# Altium project Humpback.PrjPCB (part 2 of 4)

## Sheet Supply.SchDoc: Humpback
size 420 x 297 mm; EDA_Number: ARTIQ; Projet: Humpback; Author: G.Kasprowicz; CompanyName: WUT ISE; DrawnBy: G.Kasprowicz; Organization: WUT ISE; Address1: PW ISE; Address2: Nowowiejska 15/19 00-665 Warsaw; Address3: gkasprow@gmail.com; DocumentNumber: 5; Revision: 1.0; SheetNumber: 5; SheetTotal: 11; ModifiedBy: -; CheckedDate: -; Title2: Supply v1.0; DivGrp: WUT ISE; Designer: G.Kasprowicz; ModifiedDate: -; ProjectName: Sensor Box
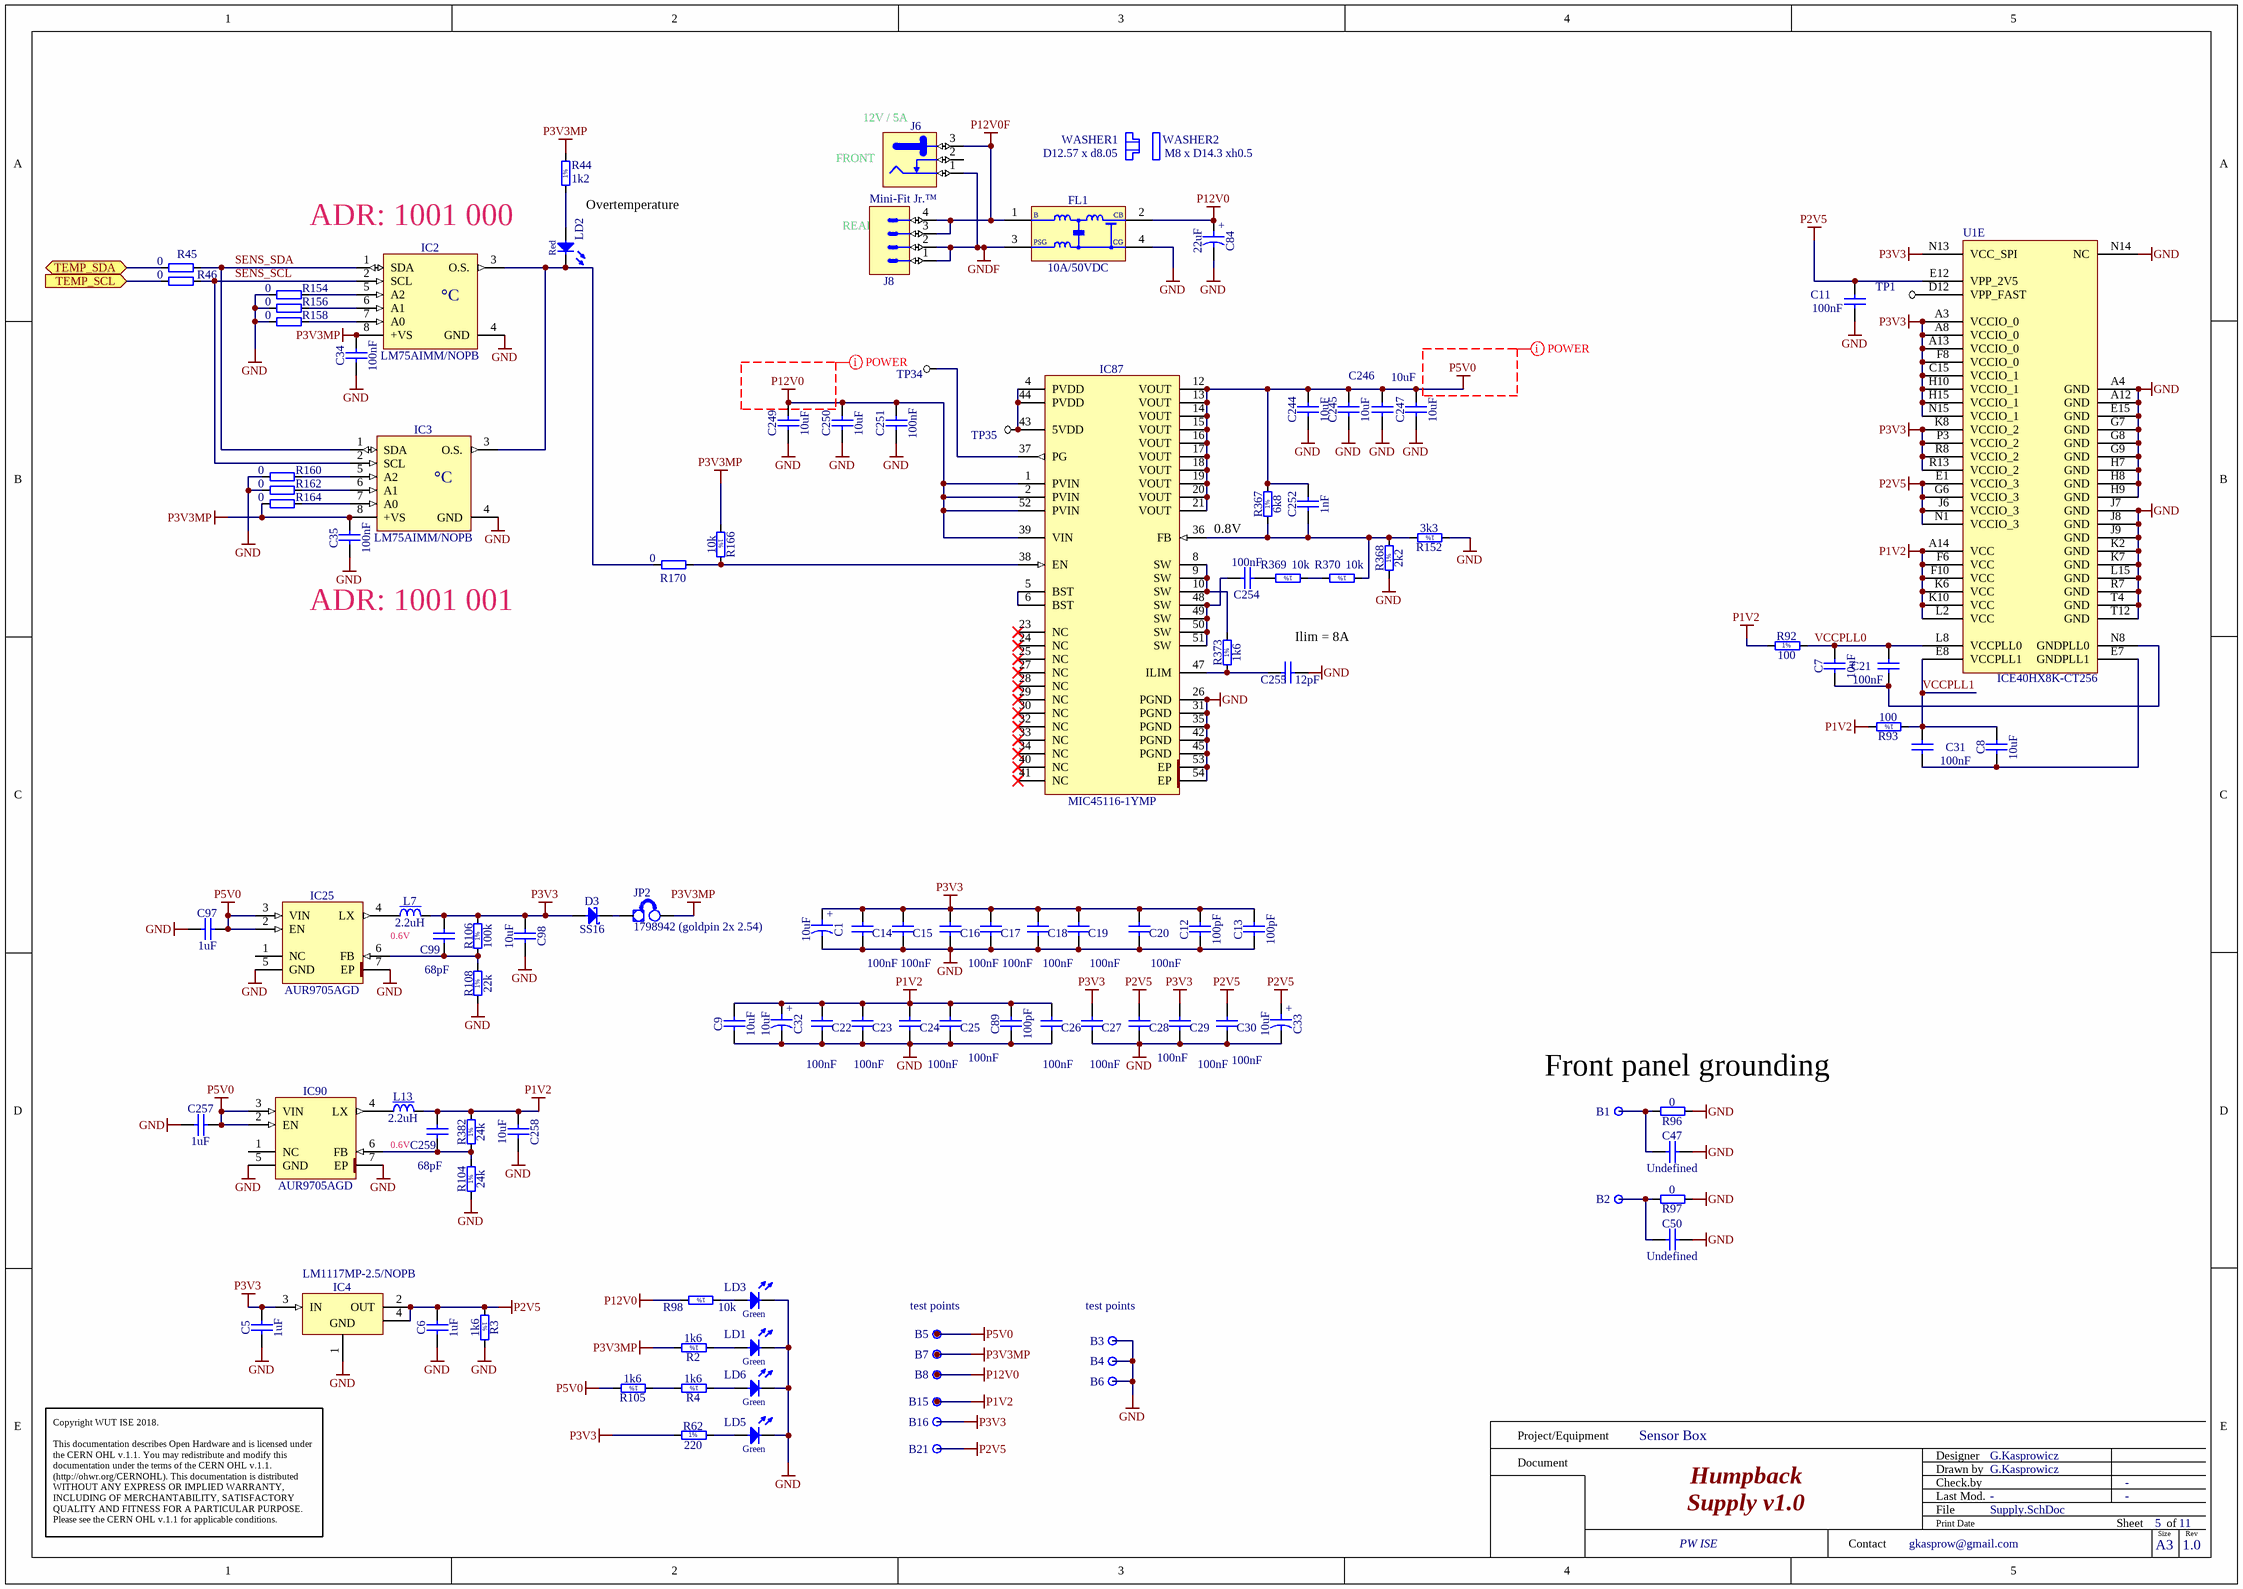
[diagram p4: Supply.SchDoc]

### Parts
B1  Plated Hole  [MTG270_500]  (value not drawn)
B2  Plated Hole  [MTG270_500]  (value not drawn)
B3  Plated Hole  [c130h60]  (value not drawn)
B4  Plated Hole  [c130h60]  (value not drawn)
B5  Plated Hole  [c130h60]  (value not drawn)
B6  Plated Hole  [c130h60]  (value not drawn)
B7  Plated Hole  [c130h60]  (value not drawn)
B8  Plated Hole  [c130h60]  (value not drawn)
B15  Plated Hole  [c130h60]  (value not drawn)
B16  Plated Hole  [c130h60]  (value not drawn)
B21  Plated Hole  [c130h60]  (value not drawn)
C1  10uF  [CAPAE430X540N]
C5  1uF  [CAPC1608X87N]
C6  1uF  [CAPC1608X87N]
C7  10uF  [CAPC1005X70N]
C8  10uF  [CAPC1005X70N]
C9  10uF  [CAPC2012X135N]
C11  100nF  [CAPC1005X55N]
C12  100pF  [CAPC1608X87N]
C13  100pF  [CAPC1608X87N]
C14  100nF  [CAPC1005X55N]
C15  100nF  [CAPC1005X55N]
C16  100nF  [CAPC1005X55N]
C17  100nF  [CAPC1005X55N]
C18  100nF  [CAPC1005X55N]
C19  100nF  [CAPC1005X55N]
C20  100nF  [CAPC1005X55N]
C21  100nF  [CAPC1005X55N]
C22  100nF  [CAPC1005X55N]
C23  100nF  [CAPC1005X55N]
C24  100nF  [CAPC1005X55N]
C25  100nF  [CAPC1005X55N]
C26  100nF  [CAPC1005X55N]
C27  100nF  [CAPC1005X55N]
C28  100nF  [CAPC1005X55N]
C29  100nF  [CAPC1005X55N]
C30  100nF  [CAPC1005X55N]
C31  100nF  [CAPC1005X55N]
C32  10uF  [CAPAE430X540N]
C33  10uF  [CAPAE430X540N]
C34  100nF  [CAPC1005X55N]
C35  100nF  [CAPC1005X55N]
C47  Undefined  [CAPC2012X135N]
C50  Undefined  [CAPC2012X135N]
C84  22uF  [CAPAE530X540N]
C89  100pF  [CAPC1608X87N]
C97  1uF  [CAPC1005X55N]
C98  10uF  [CAPC2012X135N]
C99  68pF  [CAPC1608X87N]
C244  10uF  [CAPC2012X135N]
C245  10uF  [CAPC2012X135N]
C246  10uF  [CAPC2012X135N]
C247  10uF  [CAPC2012X135N]
C249  10uF  [CAPC2012X135N]
C250  10uF  [CAPC2012X135N]
C251  100nF  [CAPC1005X55N]
C252  1nF  [CAPC1608X87N]
C254  100nF  [CAPC1005X55N]
C255  12pF  [CAPC1005X55N]
C257  1uF  [CAPC1005X55N]
C258  10uF  [CAPC2012X135N]
C259  68pF  [CAPC1608X87N]
D3  SS16  [DIOM5127X229N]
FL1  10A/50VDC  [FIL_MURATA_BNX02]
IC2  LM75AIMM/NOPB  [SOP65P490X109-8N]
IC3  LM75AIMM/NOPB  [SOP65P490X109-8N]
IC4  LM1117MP-2.5/NOPB  [SOT230P700X180-4N]
IC25  AUR9705AGD  [SON65P200X200X80-7N-R65X145]
IC87  MIC45116-1YMP  [MICROCHIP_H3QFN88-52LD-PL-3]
IC90  AUR9705AGD  [SON65P200X200X80-7N-R65X145]
J6  Jack  [SWITCHCRAFT_L712RA]  (value not drawn)
J8  Mini-Fit Jr.™  [MOLEX_39-30-0040]
JP2  1798942 (goldpin 2x 2.54)  [jump]
L7  2.2uH  [IND_MURATA_LQH44PN_P0]
L13  2.2uH  [IND_MURATA_LQH44PN_P0]
LD1  Green  [LED_KINGBRIGHT_KPH-1608CGCK]  (value not drawn)
LD2  Red  [LED_AVAGO_HSMC-C120]
LD3  Green  [LED_KINGBRIGHT_KPH-1608CGCK]  (value not drawn)
LD5  Green  [LED_KINGBRIGHT_KPH-1608CGCK]  (value not drawn)
LD6  Green  [LED_KINGBRIGHT_KPH-1608CGCK]  (value not drawn)
R2  1k6  [RESC1005X40N]
R3  1k6  [RESC1005X40N]
R4  1k6  [RESC1005X40N]
R44  1k2  [RESC1608X55N]
R45  0  [RESC1005X40N]
R46  0  [RESC1005X40N]
R62  220  [RESC1608X55N]
R92  100  [RESC1005X40N]
R93  100  [RESC1005X40N]
R96  0  [RESC1608X55N]
R97  0  [RESC1608X55N]
R98  10k  [RESC1005X40N]
R104  24k  [RESC1005X40N]
R105  1k6  [RESC1005X40N]
R106  100k  [RESC1005X40N]
R108  22k  [RESC1005X40N]
R152  3k3  [RESC1005X40N]
R154  0  [RESC1005X40N]
R156  0  [RESC1005X40N]
R158  0  [RESC1005X40N]
R160  0  [RESC1005X40N]
R162  0  [RESC1005X40N]
R164  0  [RESC1005X40N]
R166  10k  [RESC1005X40N]
R170  0  [RESC1005X40N]
R367  6k8  [RESC1005X40N]
R368  2k2  [RESC1608X55N]
R369  10k  [RESC1005X40N]
R370  10k  [RESC1005X40N]
R373  1k6  [RESC1005X40N]
R382  24k  [RESC1005X40N]
TP1  TP  [TP]  (value not drawn)
TP34  TP  [TP]  (value not drawn)
TP35  TP  [TP]  (value not drawn)
U1  ICE40HX8K-CT256  [LATC-caBGA-256]  (part E of 5)
WASHER1  D12.57 x d8.05  [Washer_s4263]
WASHER2  M8 x D14.3 xh0.5  [Washer_M8x0.5x14.3]

### Ports
TEMP_SCL (in), TEMP_SDA (bidir)

### Nets
GND: B3.1 B4.1 B6.1 C1.2 C5.1 C6.1 C9.1 C11.1 C12.1 C13.1 C14.1 C15.1 C16.1 C17.1 C18.1 C19.1 C20.1 C22.1 C23.1 C24.1 C25.1 C26.1 C27.1 C28.1 C29.1 C30.1 C32.2 C33.2 C34.1 C35.1 C47.2 C50.2 C84.2 C89.1 C97.1 C98.2 C244.1 C245.1 C246.1 C247.1 C249.1 C250.1 C251.1 C255.1 C257.1 C258.2 FL1.4(CG) IC2.4(GND) IC3.4(GND) IC4.1(GND) IC25.5(GND) IC25.7(EP) IC87.26(PGND) IC87.31(PGND) IC87.35(PGND) IC87.42(PGND) IC87.45(PGND) IC87.53(EP) IC87.54(EP) IC90.5(GND) IC90.7(EP) LD1.1(C) LD3.1(C) LD5.1(C) LD6.1(C) R3.2 R96.1 R97.1 R104.1 R108.1 R152.1 R154.1 R156.1 R158.1 R160.1 R162.1 R368.1 U1.A4(GND) U1.A12(GND) U1.E15(GND) U1.G7(GND) U1.G8(GND) U1.G9(GND) U1.H7(GND) U1.H8(GND) U1.H9(GND) U1.J7(GND) U1.J8(GND) U1.J9(GND) U1.K2(GND) U1.K7(GND) U1.L15(GND) U1.N14(NC) U1.R7(GND) U1.T4(GND) U1.T12(GND)
GNDF: FL1.3(PSG) J6.1 J8.1 J8.2
P1V2: B15.1 C9.2 C22.2 C23.2 C24.2 C25.2 C26.2 C32.1 C89.2 C258.1 C259.2 L13.2 R92.1 R93.2 R382.2 U1.A14(VCC) U1.F6(VCC) U1.F10(VCC) U1.K6(VCC) U1.K10(VCC) U1.L2(VCC)
P2V5: B21.1 C6.2 C11.2 C28.2 C30.2 C33.1 IC4.2(OUT) IC4.4(OUT) R3.1 U1.E1(VCCIO_3) U1.E12(VPP_2V5) U1.G6(VCCIO_3) U1.J6(VCCIO_3) U1.N1(VCCIO_3)
P3V3: B16.1 C1.1 C5.2 C12.2 C13.2 C14.2 C15.2 C16.2 C17.2 C18.2 C19.2 C20.2 C27.2 C29.2 C98.1 C99.2 D3.2(A) IC4.3(IN) L7.2 R62.1 R106.2 U1.A3(VCCIO_0) U1.A8(VCCIO_0) U1.A13(VCCIO_0) U1.C15(VCCIO_1) U1.F8(VCCIO_0) U1.H10(VCCIO_1) U1.H15(VCCIO_1) U1.K8(VCCIO_2) U1.N13(VCC_SPI) U1.N15(VCCIO_1) U1.P3(VCCIO_2) U1.R8(VCCIO_2) U1.R13(VCCIO_2)
P3V3MP: B7.1 C34.2 C35.2 IC2.8(+VS) IC3.8(+VS) JP2.2(E2) R2.2 R44.2 R164.1 R166.1
P5V0: B5.1 C97.2 C244.2 C245.2 C246.2 C247.2 C252.2 C257.2 IC25.2(EN) IC25.3(VIN) IC87.12(VOUT) IC87.13(VOUT) IC87.14(VOUT) IC87.15(VOUT) IC87.16(VOUT) IC87.17(VOUT) IC87.18(VOUT) IC87.19(VOUT) IC87.20(VOUT) IC87.21(VOUT) IC90.2(EN) IC90.3(VIN) R105.2 R367.2
P12V0: B8.1 C84.1 C249.2 C250.2 C251.2 FL1.2(CB) IC87.1(PVIN) IC87.2(PVIN) IC87.39(VIN) IC87.52(PVIN) R98.2
P12V0F: FL1.1(B) J6.3 J8.3 J8.4
SENS_SCL: IC2.2(SCL) IC3.2(SCL) R46.2
SENS_SDA: IC2.1(SDA) IC3.1(SDA) R45.2
TEMP_SCL: R46.1 ; port TEMP_SCL
TEMP_SDA: R45.1 ; port TEMP_SDA
VCCPLL0: C7.2 C21.2 R92.2 U1.L8(VCCPLL0)
VCCPLL1: C8.2 C31.2 R93.1 U1.E8(VCCPLL1)
NetB1_1: B1.1 C47.1 R96.2
NetB2_1: B2.1 C50.1 R97.2
NetC7_1: C7.1 C21.1 U1.N8(GNDPLL0)
NetC8_1: C8.1 C31.1 U1.E7(GNDPLL1)
NetC99_1: C99.1 IC25.6(FB) R106.1 R108.2
NetC252_1: C252.1 IC87.36(FB) R152.2 R367.1 R368.2 R370.1
NetC254_1: C254.1 R369.2
NetC254_2: C254.2 IC87.48(SW) IC87.49(SW) IC87.50(SW) IC87.51(SW)
NetC255_2: C255.2 IC87.47(ILIM) R373.1
NetC259_1: C259.1 IC90.6(FB) R104.2 R382.1
NetD3_1: D3.1(C) JP2.1(E1)
NetIC2_3: IC2.3(O.S.) IC3.3(O.S.) LD2.1(C) R170.1
NetIC2_5: IC2.5(A2) R154.2
NetIC2_6: IC2.6(A1) R156.2
NetIC2_7: IC2.7(A0) R158.2
NetIC3_5: IC3.5(A2) R160.2
NetIC3_6: IC3.6(A1) R162.2
NetIC3_7: IC3.7(A0) R164.2
NetIC25_4: IC25.4(LX) L7.1
NetIC87_4: IC87.4(PVDD) IC87.43(5VDD) IC87.44(PVDD) TP35.1
NetIC87_5: IC87.5(BST) IC87.6(BST)
NetIC87_8: IC87.8(SW) IC87.9(SW) IC87.10(SW) R373.2
NetIC87_37: IC87.37(PG) TP34.1
NetIC87_38: IC87.38(EN) R166.2 R170.2
NetIC90_4: IC90.4(LX) L13.1
NetLD1_2: LD1.2(A) R2.1
NetLD2_2: LD2.2(A) R44.1
NetLD3_2: LD3.2(A) R98.1
NetLD5_2: LD5.2(A) R62.2
NetLD6_2: LD6.2(A) R4.1
NetR4_2: R4.2 R105.1
NetR369_1: R369.1 R370.2
NetTP1_1: TP1.1 U1.D12(VPP_FAST)

Not connected (* = marked no-connect by the designer): IC25 1(NC); IC87 23(NC)* 24(NC)* 25(NC)* 27(NC)* 28(NC)* 29(NC)* 30(NC)* 32(NC)* 33(NC)* 34(NC)* 40(NC)* 41(NC)*; IC90 1(NC); J6 2

### Layout directives
net class POWER: P5V0, P12V0

### Notes on the sheet
- (near J6) 12V / 5A
- FRONT
- ADR: 1001 000
- Overtemperature
- (near J8) REAR
- 0.8V
- (near C35) ADR: 1001 001
- (near C255) Ilim = 8A
- 0.6V
- Front panel grounding
- (near B5) test points
- (near B3) test points
- Project/Equipment
- Document
- Designer
- Drawn by
- Check.by
- Copyright WUT ISE 2018.
  This documentation describes Open Hardware and is licensed under the CERN OHL v.1.1. You may redistribute and modify this documentation under the terms of the CERN OHL v.1.1. (http://ohwr.org/CERNOHL). This documentation is distributed WITHOUT ANY EXPRESS OR IMPLIED WARRANTY, INCLUDING OF MERCHANTABILITY, SATISFACTORY QUALITY AND FITNESS FOR A PARTICULAR PURPOSE. Please see the CERN OHL v.1.1 for applicable conditions.
- Contact
- File
- Last Mod.
- Print Date
- Sheet
- Size
- A3
- of
- Rev
- (in symbol CAE430-540_10UF_16V_20%) +
- (in symbol CAE530-540_22UF_16V_20%) +
- (in symbol LM75AIMM/NOPB) °C
- (in symbol R0402_1K6_1%_0.0625W_100PPM) 1%
- (in symbol R0402_3K3_1%_0.0625W_100PPM) 1%
- (in symbol R0402_6K8_1%_0.0625W_100PPM) 1%
- (in symbol R0402_10K_1%_0.0625W_100PPM) 1%
- (in symbol R0402_22K_1%_0.0625W_100PPM) 1%
- (in symbol R0402_24K_1%_0.0625W_100PPM) 1%
- (in symbol R0402_100K_1%_0.0625W_100PPM) 1%
- (in symbol R0402_100R_1%_0.0625W_100PPM) 1%
- (in symbol R0603_1K2_1%_0.1W_100PPM) 1%
- (in symbol R0603_2k2_1%_0.1W_100PPM) 1%
- (in symbol R0603_220R_1%_0.1W_100PPM) 1%

### Library data of the parts
B1 B2 = PLATED_HOLE2.7_PAD5.0: Single Terminal Socket; Part Description: Plated Through Hole: Hole Dia.=2.7mm Pad Dia.=5.0mm; Mounted: No; Part Number: PLATED_HOLE2.7_PAD5.0; Component Kind: Standard (No BOM); Component Type: Standard (No BOM); Pin Count: 1; Family: Plated Hole; Socket: No; SMD: No; Sense: No; Status: None; ComponentHeight: 0mm; HelpURL: Undefined; Author: CERN DEM JMW; CreateDate: 27.09.2011; LatestRevisionDate: 27.09.2011; PackageDescription: Plated Through Hole: Hole Dia.=2.7mm Pad Dia.=5.0mm
B3-B8 B15 B16 B21 = PLATED_HOLE0.6_PAD1.3: Single Terminal Socket; Part Description: Plated Through Hole: Hole Dia.=0.6mm Pad Dia.=1.3mm; Mounted: No; Part Number: PLATED_HOLE0.6_PAD1.3; Component Kind: Standard (No BOM); Component Type: Standard (No BOM); Pin Count: 1; Family: Plated Hole; Socket: No; SMD: No; Sense: No; Status: None; ComponentHeight: 0mm; HelpURL: Undefined; Author: CERN DEM MR; CreateDate: 02.03.2016; LatestRevisionDate: 02.03.2016; PackageDescription: Plated Through Hole: Hole Dia.=0.6mm Pad Dia.=1.3mm
C1 C32 C33 = CAE430-540_10UF_16V_20%: Polarised capacitor; Part Description: Aluminum Electrolytic SMT Capacitor; Manufacturer: PANASONIC; Manufacturer Part Number: EEEFK1C100AR; Voltage: 16V; Tolerance: ±20%; Part Number: CAE430-540_10UF_16V_20%; Component Kind: Standard; Component Type: Standard; Pin Count: 2; Value: 10uF; Status: Not Recommended; Case: B; Mounted: Yes; Socket: No; SMD: Yes; Sense: No; ComponentHeight: 5.8mm; HelpURL: \\cern.ch\dfs\Applications\Altium\Datasheets\CAE_PANASONIC_FK.pdf; Author: CERN DEM JLC; CreateDate: 03.12.2007; LatestRevisionDate: 05.11.2014
C5 C6 = CC0603_1UF_25V_10%_X7R: Non-polarised capacitor; Part Description: SMD Multilayer Chip Ceramic Capacitor; Manufacturer: GENERIC; Manufacturer1 Part Number: GRM188R71E105KA12D; Voltage: 25V; TC: X7R; Tolerance: ±10%; Table: Capacitors SMD; Part Number: CC0603_1UF_25V_10%_X7R; Component Kind: Standard; Component Type: Standard; Pin Count: 2; Value: 1uF; Status: None; Manufacturer Part Number: CC0603_1UF_25V_10%_X7R; Case: 0603; Mounted: Yes; Socket: No; SMD: Yes; Manufacturer1 Example: MURATA; Manufacturer1 ComponentHeight: 0.9mm; HelpURL: \\cern.ch\dfs\Applications\Altium\Datasheets\CC0603_X7R_MURATA.pdf; Author: CERN DEM JLC; CreateDate: 2011-01-18; LatestRevisionDate: 2011-01-18
C7 C8 = CC0402_10UF_6.3V_20%_X5R: Non-polarised capacitor; Part Description: SMD Multilayer Chip Ceramic Capacitor; Manufacturer: GENERIC; Manufacturer1 Part Number: C1005X5R0J106M050BC; Voltage: 6.3V; TC: X5R; Tolerance: ±10%; Part Number: CC0402_10UF_6.3V_20%_X5R; Component Kind: Standard; Component Type: Standard; Pin Count: 2; Value: 10uF; Status: Preferred; Manufacturer Part Number: CC0402_10UF_6.3V_20%_X5R; Case: 0402; Mounted: Yes; Socket: No; SMD: Yes; Manufacturer1 Example: TDK; Manufacturer1 ComponentHeight: 0.70mm; HelpURL: \\cern.ch\dfs\Applications\Altium\Datasheets\CC0402_X5R_TDK_C.pdf; Author: CERN DEM JLC; CreateDate: 07.01.2015; LatestRevisionDate: 07.01.2015; Sense: No
C9 C98 C244-C247 C249 C250 C258 = CC0805_10UF_16V_10%_X5R: Non-polarised capacitor; Part Description: SMD Multilayer Chip Ceramic Capacitor; Manufacturer: GENERIC; Manufacturer1 Part Number: C0805C106K4PAC; Voltage: 16V; TC: X5R; Tolerance: ±10%; Part Number: CC0805_10UF_16V_10%_X5R; Component Kind: Standard; Component Type: Standard; Pin Count: 2; Value: 10uF; Status: Preferred; Manufacturer Part Number: CC0805_10UF_16V_10%_X5R; Case: 0805; Mounted: Yes; Socket: No; SMD: Yes; Manufacturer1 Example: KEMET; Manufacturer1 ComponentHeight: 1.4mm; HelpURL: \\cern.ch\dfs\Applications\Altium\Datasheets\CC1206_X5R_KEMET.pdf; Author: CERN DEM JLC; CreateDate: 03.12.2007; LatestRevisionDate: 03.12.2007; Sense: No
C11 C14-C31 C251 C254 = CC0402_100NF_16V_10%_X5R: Non-polarised capacitor; Part Description: SMD Multilayer Chip Ceramic Capacitor; Manufacturer: GENERIC; Manufacturer1 Part Number: GRM155R61C104KA88D; Voltage: 16V; TC: X5R; Tolerance: ±10%; Table: Capacitors SMD; Part Number: CC0402_100NF_16V_10%_X5R; Component Kind: Standard; Component Type: Standard; Pin Count: 2; Value: 100nF; Status: None; Manufacturer Part Number: CC0402_100NF_16V_10%_X5R; Case: 0402; Mounted: Yes; Socket: No; SMD: Yes; Manufacturer1 Example: MURATA; Manufacturer1 ComponentHeight: 0.55mm; HelpURL: \\cern.ch\dfs\Applications\Altium\Datasheets\CC0402_X5R_MURATA_GRM.pdf; Author: CERN DEM JLC; CreateDate: 2013-12-10; LatestRevisionDate: 2013-12-10
C12 C13 C89 = CC0603_100PF_50V_10%_X7R: Non-polarised capacitor; Part Description: SMD Multilayer Chip Ceramic Capacitor; Manufacturer: GENERIC; Manufacturer1 Part Number: 223858615609; Voltage: 50V; TC: X7R; Tolerance: ±10%; Table: Capacitors SMD; Part Number: CC0603_100PF_50V_10%_X7R; Component Kind: Standard; Component Type: Standard; Pin Count: 2; Value: 100pF; Status: Preferred; Manufacturer Part Number: CC0603_100PF_50V_10%_X7R; Case: 0603; Mounted: Yes; Socket: No; SMD: Yes; Manufacturer1 Example: PHYCOMP; Manufacturer1 ComponentHeight: 0.9mm; HelpURL: \\cern.ch\dfs\Applications\Altium\Datasheets\CC0603_X7R_PHYCOMP.pdf; Author: CERN DEM JLC; CreateDate: 2012-08-15; LatestRevisionDate: 2012-08-15
C34 C35 = CC0402_100NF_16V_10%_X5R: Non-polarised capacitor; Part Description: SMD Multilayer Chip Ceramic Capacitor; Manufacturer: GENERIC; Manufacturer1 Part Number: GRM155R61C104KA88D; Voltage: 16V; TC: X5R; Tolerance: ±10%; Part Number: CC0402_100NF_16V_10%_X5R; Component Kind: Standard; Component Type: Standard; Pin Count: 2; Value: 100nF; Status: None; Manufacturer Part Number: CC0402_100NF_16V_10%_X5R; Case: 0402; Mounted: Yes; Socket: No; SMD: Yes; Sense: No; Manufacturer1 Example: MURATA; Manufacturer1 ComponentHeight: 0.55mm; HelpURL: \\cern.ch\dfs\Applications\Altium\Datasheets\CC0402_X5R_MURATA_GRM.pdf; Author: CERN DEM JLC; CreateDate: 10.12.2013; LatestRevisionDate: 10.12.2013
C47 C50 = CC0805_NO-VALUE: Non-polarised capacitor; Part Description: Reserved Footprint For 0805(2012) Chip Ceramic Capacitor; Mounted: No; Part Number: CC0805_NO-VALUE; Component Kind: Standard; Component Type: Standard; Pin Count: 2; Value: Undefined; Status: None; Manufacturer: Undefined; Manufacturer Part Number: CC0805_NO-VALUE; Case: 0805; Socket: No; SMD: Yes; Sense: No; Manufacturer1 ComponentHeight: 1.35mm; HelpURL: Undefined; Author: CERN DEM JLC; CreateDate: 10.12.2008; LatestRevisionDate: 11.09.2013
C84 = CAE530-540_22UF_16V_20%: Polarised capacitor; Part Description: Aluminum Electrolytic SMT Capacitor; Manufacturer: PANASONIC; Manufacturer Part Number: EEEFK1C220AR; Voltage: 16V; Tolerance: ±20%; Part Number: CAE530-540_22UF_16V_20%; Component Kind: Standard; Component Type: Standard; Pin Count: 2; Value: 22uF; Status: Not Recommended; Case: B; Mounted: Yes; Socket: No; SMD: Yes; Sense: No; ComponentHeight: 5.8mm; HelpURL: \\cern.ch\dfs\Applications\Altium\Datasheets\CAE_PANASONIC_FK.pdf; Author: CERN DEM JLC; CreateDate: 03.12.2007; LatestRevisionDate: 05.11.2014
C97 C257 = CC0402_1UF_16V_10%_X5R: Non-polarised capacitor; Part Description: SMD Multilayer Chip Ceramic Capacitor; Manufacturer: GENERIC; Manufacturer1 Part Number: C1005X5R1C105KT; Voltage: 16V; TC: X5R; Tolerance: ±10%; Part Number: CC0402_1UF_16V_10%_X5R; Component Kind: Standard; Component Type: Standard; Pin Count: 2; Value: 1uF; Status: Preferred; Manufacturer Part Number: CC0402_1UF_16V_10%_X5R; Case: 0402; Mounted: Yes; Socket: No; SMD: Yes; Sense: No; Manufacturer1 Example: TDK; Manufacturer1 ComponentHeight: 0.55mm; HelpURL: \\cern.ch\dfs\Applications\Altium\Datasheets\CC0402_X5R_TDK_C.pdf; Author: CERN DEM JLC; CreateDate: 25.10.2012; LatestRevisionDate: 25.10.2012
C99 C259 = CC0603_68PF_50V_5%_NP0: Non-polarised capacitor; Part Description: SMD Multilayer Chip Ceramic Capacitor; Manufacturer: GENERIC; Manufacturer1 Part Number: 223886715689; Voltage: 50V; TC: C0G/NP0; Tolerance: ±5%; Part Number: CC0603_68PF_50V_5%_NP0; Component Kind: Standard; Component Type: Standard; Pin Count: 2; Value: 68pF; Status: Preferred; Manufacturer Part Number: CC0603_68PF_50V_5%_NP0; Case: 0603; Mounted: Yes; Socket: No; SMD: Yes; Sense: No; Manufacturer1 Example: PHYCOMP; Manufacturer1 ComponentHeight: 0.87mm; HelpURL: \\cern.ch\dfs\Applications\Altium\Datasheets\CC0603_NP0_PHYCOMP.pdf; Author: CERN DEM JLC; CreateDate: 03.12.2007; LatestRevisionDate: 03.12.2007
C252 = CC0603_1NF_100V_10%_X7R: Non-polarised capacitor; Part Description: SMD Multilayer Chip Ceramic Capacitor; Manufacturer: GENERIC; Manufacturer1 Part Number: C0603C102K1RACTU; Voltage: 100V; TC: X7R; Tolerance: ±10%; Part Number: CC0603_1NF_100V_10%_X7R; Component Kind: Standard; Component Type: Standard; Pin Count: 2; Value: 1nF; Status: Preferred; Manufacturer Part Number: CC0603_1NF_100V_10%_X7R; Case: 0603; Mounted: Yes; Socket: No; SMD: Yes; Sense: No; Manufacturer1 Example: KEMET; Manufacturer1 ComponentHeight: 0.87mm; HelpURL: \\cern.ch\dfs\Applications\Altium\Datasheets\CC0603_X7R_KEMET.pdf; Author: CERN DEM JLC; CreateDate: 12.12.2013; LatestRevisionDate: 12.12.2013
C255 = CC0402_12PF_50V_5%_C0G: Non-polarised capacitor; Part Description: SMD Multilayer Chip Ceramic Capacitor; Manufacturer: GENERIC; Manufacturer1 Part Number: C0402C120J5GACTU; Voltage: 50V; TC: C0G/NP0; Tolerance: ±5%; Part Number: CC0402_12PF_50V_5%_C0G; Component Kind: Standard; Component Type: Standard; Pin Count: 2; Value: 12pF; Status: Preferred; Manufacturer Part Number: CC0402_12PF_50V_5%_C0G; Case: 0402; Mounted: Yes; Socket: No; SMD: Yes; Sense: No; Manufacturer1 Example: KEMET; Manufacturer1 ComponentHeight: 0.55mm; HelpURL: \\cern.ch\dfs\Applications\Altium\Datasheets\CC0805_C0G_KEMET_(Commercial Grade).pdf; Author: CERN DEM JLC; CreateDate: 04.10.2016; LatestRevisionDate: 04.10.2016
D3 = SS16: Schottky Diode; Part Description: Surface Mount Schottky Barrier Rectifier; Manufacturer: VISHAY GENERAL SEMICONDUCTOR; Voltage: 60V; Power: 1A; PressFit: No; Bonding: No; Part Number: SS16; Component Kind: Standard; Component Type: Standard; Device: SS16; PackageDescription: DO-214-AC Molded Diode, Body 5.1x2.7mm, IPC Medium Density; Manufacturer Part Number: SS16; Pin Count: 2; Case: DO-214AC; Mounted: Yes; Socket: No; SMD: Yes; Sense: No; ComponentHeight: 2.29mm; HelpURL: \\cern.ch\dfs\Applications\Altium\Datasheets\SS16.pdf; Author: CERN DEM JLC; CreateDate: 15/07/2008; LatestRevisionDate: 23/08/2010
FL1 = FIL_MURATA_BNX022-01L: Block Type EMIFIL (LC Combined); Part Description: Block Type EMIFIL (LC Combined) SMD Type, BNX02* Series; Manufacturer: MURATA; Resistance: 0.5R; Part Number: FIL_MURATA_BNX022-01L; Component Kind: Standard; Component Type: Standard; Pin Count: 2; Value: 10A/50VDC; Status: None; Manufacturer Part Number: BNX022-01L; Mounted: Yes; Socket: No; SMD: Yes; Sense: No; ComponentHeight: 3.3mm; HelpURL: \\cern.ch\dfs\Applications\Altium\Datasheets\FIL_MURATA_BNX022-01L.pdf; Author: CERN DEM JLC; CreateDate: 10.10.2012; LatestRevisionDate: 10.10.2012
IC2 IC3 = LM75AIMM/NOPB: Digital Temperature Sensor and Thermal Watchdog with Two-Wire Interface; Part Description: -25° to +100°C ±2°C Digital Temperature Sensor and Thermal Watchdog with Two-Wire Interface; Manufacturer: TEXAS INSTRUMENTS; PressFit: No; Bonding: No; Part Number: LM75AIMM/NOPB; Component Kind: Standard; Component Type: Standard; Device: LM75AIMM/NOPB; PackageDescription: SOP, 0.65mm pitch; 8 pin,3.00mm W X 3.00mm L X 1.09mm H bodyI, PC Medium Density; Manufacturer Part Number: LM75AIMM/NOPB; Pin Count: 8; Case: SSOP8; Mounted: Yes; Socket: No; SMD: Yes; Sense: No; ComponentHeight: 1.09mm; HelpURL: \\cern.ch\dfs\Applications\Altium\Datasheets\LM75AIMM-NOPB.pdf; Author: CERN DEM JLC; CreateDate: 15.10.2012; LatestRevisionDate: 15.10.2012
IC4 = LM1117MP-2.5/NOPB: 3-Terminal Regulator 1=GND 2=OUT 3=IN 4=OUT; Part Description: 2.5V 800mA Low-Dropout Linear Regulator; Manufacturer: TEXAS INSTRUMENTS; PressFit: No; Bonding: No; Part Number: LM1117MP-2.5/NOPB; Component Kind: Standard; Component Type: Standard; Device: LM1117MP-2.5/NOPB; PackageDescription: SOT223, 2.30mm pitch; 3 pin, 3.70mm W X 6.70mm L, IPC Medium Density; Manufacturer Part Number: LM1117MP-2.5/NOPB; Pin Count: 4; Case: SOT223; Mounted: Yes; Socket: No; SMD: Yes; Sense: No; ComponentHeight: 1.8mm; HelpURL: \\cern.ch\dfs\Applications\Altium\Datasheets\LM1117MP-2.5-NOPB.pdf; Author: CERN DEM JLC; CreateDate: 23/02/2015; LatestRevisionDate: 23/02/2015
IC25 IC90 = AUR9705AGD: 0V to 6V Input, 1A, 1.5MHz, Step-Down DC-DC Converter; Manufacturer: DIODES INCORPORATED; PressFit: No; Bonding: No; Part Number: AUR9705AGD; Component Kind: Standard; Component Type: Standard; Device: AUR9705AGD; PackageDescription: SON, 0.65mm Pitch, 6 Pin, 2.00mm W X 2.00mm L X 0.80mm H body (W/Thermal Tab 0.65mm X 1.45mm), IPC Medium Density; Part Description: 0V to 6V Input, 1A, 1.5MHz, Step-Down DC-DC Converter; Manufacturer Part Number: AUR9705AGD; Pin Count: 7; Case: SON6; Mounted: Yes; Socket: No; SMD: Yes; Sense: No; ComponentHeight: 0.8mm; HelpURL: \\cern.ch\dfs\Applications\Altium\Datasheets\AUR9705AGD.pdf; Author: CERN DEM MR; CreateDate: 15.02.2018; LatestRevisionDate: 15.02.2018
IC87 = MIC45116-1YMP: 0.8V to 85% PVIN (4.75-19V), 6A Synchronous Step-Down Regulator Module; Manufacturer: MICROCHIP TECHNOLOGY; PressFit: No; Bonding: No; Part Number: MIC45116-1YMP; Component Kind: Standard; Component Type: Standard; Device: MIC45116-1YMP; PackageDescription: MICROCHIP_H3QFN88-52LD-PL-3, 0.50mm Pitch, Square, 52 Pin, 8mm L X 8mm W X 3mm H Body; Part Description: 0.8V to 85% PVIN (4.75-19V), 6A Synchronous Step-Down Regulator Module; Manufacturer Part Number: MIC45116-1YMP; Pin Count: 53; Mounted: Yes; Socket: No; SMD: Yes; Sense: No; ComponentHeight: 3mm; HelpURL: \\cern.ch\dfs\Applications\Altium\Datasheets\MIC45116-1YMP.pdf; Author: CERN DEM JMW; CreateDate: 15.08.2016; LatestRevisionDate: 15.08.2016
J6 = CON_DC_5A_THT_RA: 24V /3. 5A, 2.1mm Diameter Pin, SMD DC Power Supply Connector With  Break Contact; Part Description: 12V/5A, 2.5mm Diameter Pin, THT DC Power Supply Connector With  Break Contact; Manufacturer: SWITCHCRAFT; Manufacturer Part Number: L712RA; PressFit: No; Part Number: SWITCHCRAFT_L712RA; Component Kind: Standard; Component Type: Standard; Pin Count: 3; Family: Jack; Mounted: Yes; Socket: No; SMD: No; Sense: No; Status: None; ComponentHeight: 11mm; HelpURL: \\cern.ch\dfs\Applications\Altium\Datasheets\LUMBERG_161314.pdf; Author: GK; CreateDate: 15.02.2011; LatestRevisionDate: 20.07.2011
J8 = MOLEX_39-30-0040: Connector 4 Male; Part Description: 4.20mm (.165") Pitch Mini-Fit Jr. Header, Dual Row, Right Angle with Snap-in Plastic Peg PCB Lock, 4 Circuits; Manufacturer: MOLEX; PressFit: No; Part Number: MOLEX_39-30-0040; Component Kind: Standard; Component Type: Standard; Pin Count: 4; Family: Mini-Fit Jr.™; Mounted: Yes; Socket: No; SMD: No; Sense: No; Status: None; Manufacturer Part Number: 39-30-0040; ComponentHeight: 11.4mm; HelpURL: \\cern.ch\dfs\Applications\Altium\Datasheets\MOLEX_39-30-0040.pdf; Author: CERN DEM JLC; CreateDate: 02/10/2018; LatestRevisionDate: 02/10/2018
JP2 = JUMPER: Supplier 1: Farnell; Supplier Part Number 1: 1798942
L7 L13 = IND_2.2UH_20%_MURATA_LQH44PN2R2MP0L: Inductor With Core; Part Description: Wire Wound Ferrite Inductor for Power Lines; Manufacturer: MURATA; Power: 1.8A; Resistance: 0R049; Tolerance: ±20%; Part Number: IND_2.2UH_20%_MURATA_LQH44PN2R2MP0L; Component Kind: Standard; Component Type: Standard; Pin Count: 2; Value: 2.2uH; Status: None; Manufacturer Part Number: LQH44PN2R2MP0L; Case: 4040; Mounted: Yes; Socket: No; SMD: Yes; Sense: No; ComponentHeight: 1.8mm; HelpURL: \\cern.ch\dfs\Applications\Altium\Datasheets\IND_MURATA_LQH44PN_P0.pdf; Author: CERN DEM JLC; CreateDate: 14.02.2018; LatestRevisionDate: 14.02.2018
LD1 LD3 LD5 LD6 = LED_KINGBRIGHT_KPH-1608CGCK: LED Green 1C 2A; Part Description: SMD Green LED, Case 1.6mmX0.8mm(0603), 0.65mm Thickness; PressFit: No; Bonding: No; Part Number: LED_KINGBRIGHT_KPH-1608CGCK; Component Kind: Standard; Component Type: Standard; Color: Green; PackageDescription: SMT Green LED, Case 0603, Body L 1.6 x W 0.8mm H 0.65mm; Manufacturer: KINGBRIGHT; Manufacturer Part Number: KPH-1608CGCK; Pin Count: 2; Mounted: Yes; Socket: No; SMD: Yes; Sense: No; ComponentHeight: 0.65mm; HelpURL: \\cern.ch\dfs\Applications\Altium\Datasheets\LED_KINGBRIGHT_KPH-1608CGCK.pdf; Author: CERN DEM JLC; CreateDate: 03.07.2017; LatestRevisionDate: 03.07.2017
LD2 = LED_AVAGO_HSMC-C120: LED Red 1C 2A; Part Description: High Performance Right Angle Chip Red LED; Manufacturer: AVAGO TECHNOLOGIES; PressFit: No; Bonding: No; Part Number: LED_AVAGO_HSMC-C120; Component Kind: Standard; Component Type: Standard; Color: Red; PackageDescription: Red Chip LED, 2-Leads, Body 1.7x1.1mm, Side Emitting Package; Manufacturer Part Number: HSMC-C120; Pin Count: 2; Mounted: Yes; Socket: No; SMD: Yes; Sense: No; ComponentHeight: 0.7mm; HelpURL: \\cern.ch\dfs\Applications\Altium\Datasheets\LED_AVAGO_HSMC-C120.pdf; ComponentLink1URL: \\cern.ch\dfs\Applications\Altium\Datasheets\LED_AVAGO_HSMC-C120_DESIGN-GUIDE.pdf; ComponentLink1Description: Design Guide; Author: CERN DEM JMW; CreateDate: 22/07/2009; LatestRevisionDate: 20/06/2012
R2-R4 R105 R373 = R0402_1K6_1%_0.0625W_100PPM: Resistor - 1%; Part Description: General Purpose Thick Film Chip Resistor; Manufacturer: GENERIC; Manufacturer1 Part Number: 232270671602L; TC: ±100ppm/°C; PressFit: No; Part Number: R0402_1K6_1%_0.0625W_100PPM; Component Kind: Standard; Component Type: Standard; Pin Count: 2; Value: 1k6; Status: Not Recommended; Power: 0.0625W; Tolerance: ±1%; Manufacturer Part Number: R0402_1K6_1%_0.0625W_100PPM; Case: 0402; Mounted: Yes; Sense: No; Socket: No; SMD: Yes; Manufacturer1 Example: YAGEO PHYCOMP; Manufacturer1 ComponentHeight: 0.4mm; HelpURL: \\cern.ch\dfs\Applications\Altium\Datasheets\R0402_Phycomp_RC0402.pdf; Author: CERN DEM JLC; CreateDate: 03.12.2007; LatestRevisionDate: 17.10.2012
R44 = R0603_1K2_1%_0.1W_100PPM: Resistor - 1%; Part Description: General Purpose Thick Film Chip Resistor; Manufacturer: GENERIC; Manufacturer1 Part Number: NRC06F1201TRF; Power: 0.1W; TC: ±100ppm/°C; Part Number: R0603_1K2_1%_0.1W_100PPM; Component Kind: Standard; Component Type: Standard; Pin Count: 2; Value: 1k2; Status: Preferred; Tolerance: ±1%; Manufacturer Part Number: R0603_1K2_1%_0.1W_100PPM; Case: 0603; Mounted: Yes; Sense: No; Socket: No; SMD: Yes; Manufacturer1 Example: NIC COMPONENT; Manufacturer1 ComponentHeight: 0.55mm; HelpURL: \\cern.ch\dfs\Applications\Altium\Datasheets\R0603_NIC_NRC.pdf; Author: CERN DEM JLC; CreateDate: 03.12.2007; LatestRevisionDate: 13.03.2008
R45 R46 R154 R156 R158 R160 R162 R164 R170 = R0402_0R_JUMPER: Resistor; Part Description: 1A (0.05R Max DC Resistance) Zero Ohm Jumper; Manufacturer: GENERIC; Manufacturer1 Part Number: 232270591001L; Part Number: R0402_0R_JUMPER; Component Kind: Standard; Component Type: Standard; Pin Count: 2; Value: 0; Status: Not recommended; Manufacturer Part Number: R0402_0R_JUMPER; Case: 0402; Mounted: Yes; Sense: No; Socket: No; SMD: Yes; Manufacturer1 Example: YAGEO PHYCOMP; Manufacturer1 ComponentHeight: 0.4mm; HelpURL: \\cern.ch\dfs\Applications\Altium\Datasheets\R0402_Phycomp_RC0402.pdf; Author: CERN DEM JLC; CreateDate: 03.12.2007; LatestRevisionDate: 17.10.2012
R62 = R0603_220R_1%_0.1W_100PPM: Resistor - 1%; Part Description: General Purpose Thick Film Chip Resistor; Manufacturer: GENERIC; Manufacturer1 Part Number: NRC06F2200TRF; Power: 0.1W; TC: ±100ppm/°C; Part Number: R0603_220R_1%_0.1W_100PPM; Component Kind: Standard; Component Type: Standard; Pin Count: 2; Value: 220; Status: Preferred; Tolerance: ±1%; Manufacturer Part Number: R0603_220R_1%_0.1W_100PPM; Case: 0603; Mounted: Yes; Sense: No; Socket: No; SMD: Yes; Manufacturer1 Example: NIC COMPONENT; Manufacturer1 ComponentHeight: 0.55mm; HelpURL: \\cern.ch\dfs\Applications\Altium\Datasheets\R0603_NIC_NRC.pdf; Author: CERN DEM JLC; CreateDate: 03.12.2007; LatestRevisionDate: 13.03.2008
R92 R93 = R0402_100R_1%_0.0625W_100PPM: Resistor - 1%; Part Description: General Purpose Thick Film Chip Resistor; Manufacturer: GENERIC; Manufacturer1 Part Number: 232270671001L; TC: ±100ppm/°C; Table: Resistors SMD; Part Number: R0402_100R_1%_0.0625W_100PPM; Component Kind: Standard; Component Type: Standard; Pin Count: 2; Value: 100; Status: Not recommended; Power: 0.0625W; Tolerance: ±1%; Manufacturer Part Number: R0402_100R_1%_0.0625W_100PPM; Case: 0402; Mounted: Yes; Socket: No; SMD: Yes; Manufacturer1 Example: YAGEO PHYCOMP; Manufacturer1 ComponentHeight: 0.4mm; HelpURL: \\cern.ch\dfs\Applications\Altium\Datasheets\R0402_Phycomp_RC0402.pdf; Author: CERN DEM JLC; CreateDate: 2007-12-03; LatestRevisionDate: 2012-10-17
R96 R97 = R0603_0R_JUMPER: Resistor; Part Description: 1A (0.05R Max DC Resistance) Zero Ohm Jumper; Manufacturer: GENERIC; Manufacturer1 Part Number: NRC06Z0; PressFit: No; Part Number: R0603_0R_JUMPER; Component Kind: Standard; Component Type: Standard; Pin Count: 2; Value: 0; Status: Preferred; Manufacturer Part Number: R0603_0R_JUMPER; Case: 0603; Mounted: Yes; Sense: No; Socket: No; SMD: Yes; Manufacturer1 Example: NIC COMPONENT; Manufacturer1 ComponentHeight: 0.55mm; HelpURL: \\cern.ch\dfs\Applications\Altium\Datasheets\R0603_NIC_NRC.pdf; Author: CERN DEM JLC; CreateDate: 03.12.2007; LatestRevisionDate: 13.03.2008
R98 = R0402_10K_1%_0.0625W_100PPM: Resistor - 1%; Part Description: General Purpose Thick Film Chip Resistor; Manufacturer: GENERIC; Manufacturer1 Part Number: 232270671003L; TC: ±100ppm/°C; Part Number: R0402_10K_1%_0.0625W_100PPM; Component Kind: Standard; Component Type: Standard; Pin Count: 2; Value: 10k; Status: Not recommended; Power: 0.0625W; Tolerance: ±1%; Manufacturer Part Number: R0402_10K_1%_0.0625W_100PPM; Case: 0402; Mounted: Yes; Sense: No; Socket: No; SMD: Yes; Manufacturer1 Example: YAGEO PHYCOMP; Manufacturer1 ComponentHeight: 0.4mm; HelpURL: \\cern.ch\dfs\Applications\Altium\Datasheets\R0402_Phycomp_RC0402.pdf; Author: CERN DEM JLC; CreateDate: 03.12.2007; LatestRevisionDate: 17.10.2012
R104 R382 = R0402_24K_1%_0.0625W_100PPM: Resistor - 1%; Part Description: General Purpose Thick Film Chip Resistor; Manufacturer: GENERIC; Manufacturer1 Part Number: 232270672403L; TC: ±100ppm/°C; PressFit: No; Part Number: R0402_24K_1%_0.0625W_100PPM; Component Kind: Standard; Component Type: Standard; Pin Count: 2; Value: 24k; Status: Not Recommended; Power: 0.0625W; Tolerance: ±1%; Manufacturer Part Number: R0402_24K_1%_0.0625W_100PPM; Case: 0402; Mounted: Yes; Sense: No; Socket: No; SMD: Yes; Manufacturer1 Example: YAGEO PHYCOMP; Manufacturer1 ComponentHeight: 0.4mm; HelpURL: \\cern.ch\dfs\Applications\Altium\Datasheets\R0402_Phycomp_RC0402.pdf; Author: CERN DEM JLC; CreateDate: 03/12/2007; LatestRevisionDate: 17/10/2012
R106 = R0402_100K_1%_0.0625W_100PPM: Resistor - 1%; Part Description: General Purpose Thick Film Chip Resistor; Manufacturer: GENERIC; Manufacturer1 Part Number: 232270671004L; TC: ±100ppm/°C; PressFit: No; Part Number: R0402_100K_1%_0.0625W_100PPM; Component Kind: Standard; Component Type: Standard; Pin Count: 2; Value: 100k; Status: Not Recommended; Power: 0.0625W; Tolerance: ±1%; Manufacturer Part Number: R0402_100K_1%_0.0625W_100PPM; Case: 0402; Mounted: Yes; Sense: No; Socket: No; SMD: Yes; Manufacturer1 Example: YAGEO PHYCOMP; Manufacturer1 ComponentHeight: 0.4mm; HelpURL: \\cern.ch\dfs\Applications\Altium\Datasheets\R0402_Phycomp_RC0402.pdf; Author: CERN DEM JLC; CreateDate: 03.12.2007; LatestRevisionDate: 17.10.2012
R108 = R0402_22K_1%_0.0625W_100PPM: Resistor - 1%; Part Description: General Purpose Thick Film Chip Resistor; Manufacturer: GENERIC; Manufacturer1 Part Number: 232270672203L; TC: ±100ppm/°C; PressFit: No; Part Number: R0402_22K_1%_0.0625W_100PPM; Component Kind: Standard; Component Type: Standard; Pin Count: 2; Value: 22k; Status: Not Recommended; Power: 0.0625W; Tolerance: ±1%; Manufacturer Part Number: R0402_22K_1%_0.0625W_100PPM; Case: 0402; Mounted: Yes; Sense: No; Socket: No; SMD: Yes; Manufacturer1 Example: YAGEO PHYCOMP; Manufacturer1 ComponentHeight: 0.4mm; HelpURL: \\cern.ch\dfs\Applications\Altium\Datasheets\R0402_Phycomp_RC0402.pdf; Author: CERN DEM JLC; CreateDate: 03.12.2007; LatestRevisionDate: 17.10.2012
R152 = R0402_3K3_1%_0.0625W_100PPM: Resistor - 1%; Part Description: General Purpose Thick Film Chip Resistor; Manufacturer: GENERIC; Manufacturer1 Part Number: 232270673302L; TC: ±100ppm/°C; PressFit: No; Part Number: R0402_3K3_1%_0.0625W_100PPM; Component Kind: Standard; Component Type: Standard; Pin Count: 2; Value: 3k3; Status: Not Recommended; Power: 0.0625W; Tolerance: ±1%; Manufacturer Part Number: R0402_3K3_1%_0.0625W_100PPM; Case: 0402; Mounted: Yes; Sense: No; Socket: No; SMD: Yes; Manufacturer1 Example: YAGEO PHYCOMP; Manufacturer1 ComponentHeight: 0.4mm; HelpURL: \\cern.ch\dfs\Applications\Altium\Datasheets\R0402_Phycomp_RC0402.pdf; Author: CERN DEM JLC; CreateDate: 03/12/2007; LatestRevisionDate: 17/10/2012
R166 = R0402_10K_1%_0.0625W_100PPM: Resistor - 1%; Part Description: General Purpose Thick Film Chip Resistor; Manufacturer: GENERIC; Manufacturer1 Part Number: 232270671003L; TC: ±100ppm/°C; PressFit: No; Part Number: R0402_10K_1%_0.0625W_100PPM; Component Kind: Standard; Component Type: Standard; Pin Count: 2; Value: 10k; Status: Not Recommended; Power: 0.0625W; Tolerance: ±1%; Manufacturer Part Number: R0402_10K_1%_0.0625W_100PPM; Case: 0402; Mounted: Yes; Sense: No; Socket: No; SMD: Yes; Manufacturer1 Example: YAGEO PHYCOMP; Manufacturer1 ComponentHeight: 0.4mm; HelpURL: \\cern.ch\dfs\Applications\Altium\Datasheets\R0402_Phycomp_RC0402.pdf; Author: CERN DEM JLC; CreateDate: 03.12.2007; LatestRevisionDate: 17.10.2012
R367 = R0402_6K8_1%_0.0625W_100PPM: Resistor - 1%; Part Description: General Purpose Thick Film Chip Resistor; Manufacturer: GENERIC; Manufacturer1 Part Number: 232270676802L; TC: ±100ppm/°C; PressFit: No; Part Number: R0402_6K8_1%_0.0625W_100PPM; Component Kind: Standard; Component Type: Standard; Pin Count: 2; Value: 6k8; Status: Not Recommended; Power: 0.0625W; Tolerance: ±1%; Manufacturer Part Number: R0402_6K8_1%_0.0625W_100PPM; Case: 0402; Mounted: Yes; Sense: No; Socket: No; SMD: Yes; Manufacturer1 Example: YAGEO PHYCOMP; Manufacturer1 ComponentHeight: 0.4mm; HelpURL: \\cern.ch\dfs\Applications\Altium\Datasheets\R0402_Phycomp_RC0402.pdf; Author: CERN DEM JLC; CreateDate: 03.12.2007; LatestRevisionDate: 17.10.2012
R368 = R0603_2k2_1%_0.1W_100PPM: Resistor - 1%; Part Description: General Purpose Thick Film Chip Resistor; Manufacturer: GENERIC; Manufacturer1 Part Number: NRC06F2201TRF; Power: 0.1W; TC: ±100ppm/°C; PressFit: No; Part Number: R0603_2K2_1%_0.1W_100PPM; Component Kind: Standard; Component Type: Standard; Pin Count: 2; Value: 2k2; Status: Preferred; Tolerance: ±1%; Manufacturer Part Number: R0603_2K2_1%_0.1W_100PPM; Case: 0603; Mounted: Yes; Sense: No; Socket: No; SMD: Yes; Manufacturer1 Example: NIC COMPONENT; Manufacturer1 ComponentHeight: 0.55mm; HelpURL: \\cern.ch\dfs\Applications\Altium\Datasheets\R0603_NIC_NRC.pdf; Author: CERN DEM JLC; CreateDate: 03/12/2007; LatestRevisionDate: 13/03/2008
R369 R370 = R0402_10K_1%_0.0625W_100PPM: Resistor - 1%; Part Description: General Purpose Thick Film Chip Resistor; Manufacturer: GENERIC; Manufacturer1 Part Number: 232270671003L; TC: ±100ppm/°C; Table: Resistors SMD; Part Number: R0402_10K_1%_0.0625W_100PPM; Component Kind: Standard; Component Type: Standard; Pin Count: 2; Value: 10k; Status: Not recommended; Power: 0.0625W; Tolerance: ±1%; Manufacturer Part Number: R0402_10K_1%_0.0625W_100PPM; Case: 0402; Mounted: Yes; Socket: No; SMD: Yes; Manufacturer1 Example: YAGEO PHYCOMP; Manufacturer1 ComponentHeight: 0.4mm; HelpURL: \\cern.ch\dfs\Applications\Altium\Datasheets\R0402_Phycomp_RC0402.pdf; Author: CERN DEM JLC; CreateDate: 2007-12-03; LatestRevisionDate: 2012-10-17
TP1 TP34 TP35 = TP: Testpoint
U1 = CMP-0962-00001-1: iCE40 HX8K Series FPGA Family, 7680 Logic Cells, 1.2 V Core, 128 K Embedded RAM Bits, 256-ball caBGA, Pb-Free, Tray; Manufacturer: Lattice Semiconductor; Supply Voltage: 1.2V; Phase-Locked Loops: 2; Logic Cells: 7680; Embedded RAM Bits: 128K; PackageReference: caBGA-256; PackageDescription: 256-Ball Chip Array Ball Grid Array, Body 14 x 14 mm, Pitch 0.8 mm; RoHS: TRUE; Packing: Tray; Mounting Technology: Surface Mount; ComponentLink3URL: http://www.latticesemi.com/lit/docs/package/pkg.pdf; ComponentLink1Description: Manufacturer URL; ComponentLink3Description: Package Specification; Code_JEDEC: MO-275; PackageVersion: Rev. 03.9, 02/2013; ComponentLink1URL: http://www.latticesemi.com/en; ComponentLink2URL: http://www.latticesemi.com/~/media/Documents/DataSheets/iCE/iCE40LPHXFamilyDataSheet.pdf; PartNumber: ICE40HX8K-CT256; ComponentLink2Description: Datasheet; DatasheetVersion: Rev. 02.9
WASHER1 = MECH_Washer_s4263: 8mm_Shoulder Washer; Part Number: Switchcraft_s4263; Part Description: Plastic Shoulder Washer; Manufacturer: Switchcraft; Manufacturer Part Number: s4263; PressFit: No; Component Kind: Standard; Component Type: Mechanical; Pin Count: 0; PackageDescription: Plastic Shoulder Washer; Mounted: Yes; Socket: No; SMD: No; Sense: No; Status: None; Value: D12.57 x d8.05; ComponentHeight: 3.95mm; Author: GK; CreateDate: 28.01.2016; LatestRevisionDate: 28.01.2016
WASHER2 = MECH_Washer_M8x0.5x14.3: M8 x0.5x14.3 Nylon Washer; Part Number: WS-M 8-0.5(14.3); Manufacturer: ADSYS ELEMENTY; PressFit: No; Component Kind: Standard; Component Type: Mechanical; Footprint: WS-M 8-0.5(14.3); Pin Count: 0; PackageDescription: Nylon Washer; Mounted: Yes; Socket: No; SMD: No; Sense: No; Status: None; Value: M8 x D14.3 xh0.5; Part Description: Nylon Washer; Manufacturer Part Number: WS-M 8-0.5(14.3); ComponentHeight: 3.95mm; HelpURL: \\cern.ch\dfs\Applications\Altium\Datasheets\AAVID-THERMALLOY_7721-7PPSG.pdf; Author: GK; CreateDate: 28.01.2016; LatestRevisionDate: 28.01.2016